# EAGLE design POV (EAGLE 9.6.2)
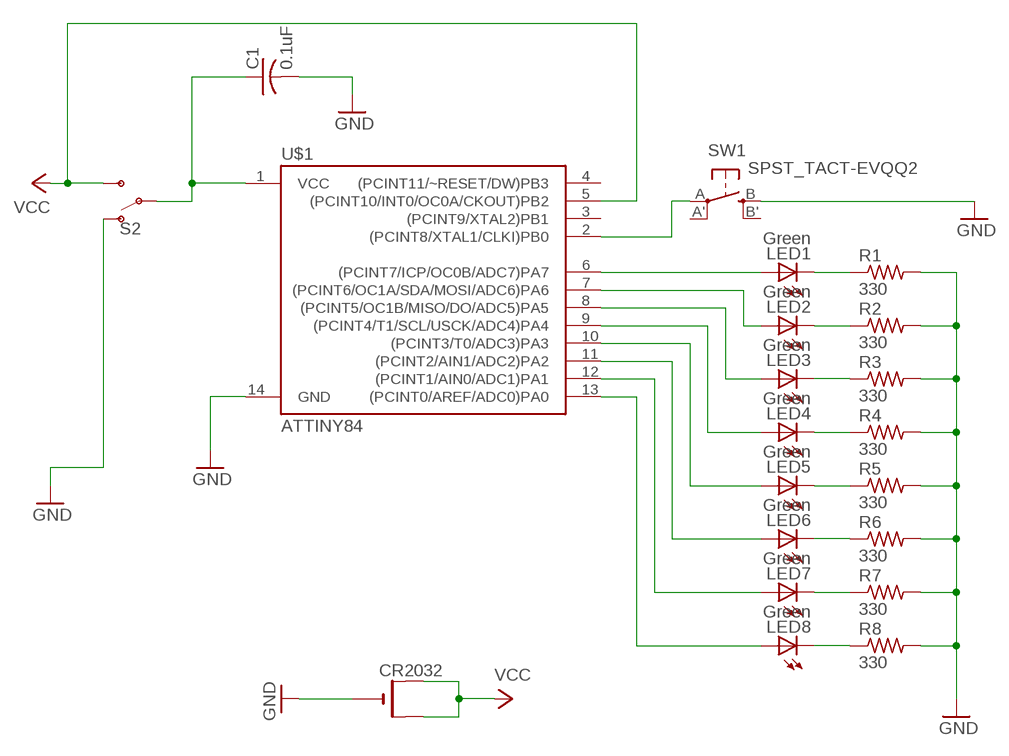
[diagram p0: schematic, sheet 1]

## Parts
C1  0.1uF  C-USC0805  [C0805]
CR2032  CR2032SMT  [CR2032-SMD]
LED1  Green  LEDCHIP-LED0805  [CHIP-LED0805]
LED2  Green  LEDCHIP-LED0805  [CHIP-LED0805]
LED3  Green  LEDCHIP-LED0805  [CHIP-LED0805]
LED4  Green  LEDCHIP-LED0805  [CHIP-LED0805]
LED5  Green  LEDCHIP-LED0805  [CHIP-LED0805]
LED6  Green  LEDCHIP-LED0805  [CHIP-LED0805]
LED7  Green  LEDCHIP-LED0805  [CHIP-LED0805]
LED8  Green  LEDCHIP-LED0805  [CHIP-LED0805]
R1  330  R-US_M0805  [M0805]
R2  330  R-US_M0805  [M0805]
R3  330  R-US_M0805  [M0805]
R4  330  R-US_M0805  [M0805]
R5  330  R-US_M0805  [M0805]
R6  330  R-US_M0805  [M0805]
R7  330  R-US_M0805  [M0805]
R8  330  R-US_M0805  [M0805]
S2  SWITCH-SPDT-SMD-AYZ0202  [SWITCH_DPDT_SMD_AYZ0202]
SW1  SPST_TACT-EVQQ2  [EVQ-Q2]
U$1  ATTINY84  [SO14]

## Nets
GND: C1.2 CR2032.- R1.2 R2.2 R3.2 R4.2 R5.2 R6.2 R7.2 R8.2 S2.1(O) SW1.B(S) U$1.14(GND)
N$1: LED1.A U$1.6((PCINT7/ICP/OC0B/ADC7)PA7)
N$2: LED1.C R1.1
N$3: LED2.C R2.1
N$4: LED3.C R3.1
N$5: LED4.C R4.1
N$6: LED5.C R5.1
N$7: LED6.C R6.1
N$8: LED7.C R7.1
N$9: LED8.C R8.1
N$10: LED2.A U$1.7((PCINT6/OC1A/SDA/MOSI/ADC6)PA6)
N$11: LED3.A U$1.8((PCINT5/OC1B/MISO/DO/ADC5)PA5)
N$12: LED4.A U$1.9((PCINT4/T1/SCL/USCK/ADC4)PA4)
N$13: LED5.A U$1.10((PCINT3/T0/ADC3)PA3)
N$14: LED6.A U$1.11((PCINT2/AIN1/ADC2)PA2)
N$15: LED7.A U$1.12((PCINT1/AIN0/ADC1)PA1)
N$16: LED8.A U$1.13((PCINT0/AREF/ADC0)PA0)
N$17: C1.1 S2.2(P) U$1.1(VCC)
N$18: SW1.A(P) U$1.2((PCINT8/XTAL1/CLKI)PB0)
VCC: CR2032.+$1(+) CR2032.+$2(+1) S2.3(S) U$1.5((PCINT10/INT0/OC0A/CKOUT)PB2)
Unconnected: SW1.A'(P1) SW1.B'(S1) U$1.3((PCINT9/XTAL2)PB1) U$1.4((PCINT11/~RESET/DW)PB3)

## Library data of the parts
C1 = adafruit:C-US: CAPACITOR, American symbol
CR2032 = adafruit:CR2032
LED1-LED8 = Fidget Spinner Example:LED: LED OSRAM: - CHIPLED LG R971, LG N971, LY N971, LG Q971, LY Q971, LO R971, LY R971 LH N974, LH R974 LS Q976, LO Q976, LY Q976 LO Q996 - Hyper CHIPLED LW Q18S LB Q993, LB Q99A, LB R99A - SideLED LS A670, LO A670, LY A670, LG A670, LP A670 LB A673, LV A673, LT A673, LW A673 LH A674 LY A675 LS A676, LA A676, LO A676, LY A676, LW A676 LS A679, LY A679, LG A679 - Hyper Micro SIDELED® LS Y876, LA Y876, LO Y876, LY Y876 LT Y87S - SmartLED LW L88C, LW L88S LB L89C, LB L89S, LG L890 LS L89K, LO L89K, LY L89K LS L896, LA L896, LO L896, LY L896 - TOPLED LS T670, LO T670, LY T670, LG T670, LP T670 LSG T670, LSP T670, LSY T670, LOP T670, LYG T670 LG T671, LOG T671, LSG T671 LB T673, LV T673, LT T673, LW T673 LH T674 LS T676, LA T676, LO T676, LY T676, LB T676, LH T676, LSB T676, LW T676 LB T67C, LV T67C, LT T67C, LS T67K, LO T67K, LY T67K, LW E67C LS E67B, LA E67B, LO E67B, LY E67B, LB E67C, LV E67C, LT E67C LW T67C LS T679, LY T679, LG T679 LS T770, LO T770, LY T770, LG T770, LP T770 LB T773, LV T773, LT T773, LW T773 LH T774 LS E675, LA E675, LY E675, LS T675 LS T776, LA T776, LO T776, LY T776, LB T776 LHGB T686 LT T68C, LB T68C - Hyper Mini TOPLED® LB M676 - Mini TOPLED Santana® LG M470 LS M47K, LO M47K, LY M47K Source: http://www.osram.convergy.de LUXEON: - LUMILED® LXK2-PW12-R00, LXK2-PW12-S00, LXK2-PW14-U00, LXK2-PW14-V00 LXK2-PM12-R00, LXK2-PM12-S00, LXK2-PM14-U00 LXK2-PE12-Q00, LXK2-PE12-R00, LXK2-PE12-S00, LXK2-PE14-T00, LXK2-PE14-U00 LXK2-PB12-K00, LXK2-PB12-L00, LXK2-PB12-M00, LXK2-PB14-N00, LXK2-PB14-P00, LXK2-PB14-Q00 LXK2-PR12-L00, LXK2-PR12-M00, LXK2-PR14-Q00, LXK2-PR14-R00 LXK2-PD12-Q00, LXK2-PD12-R00, LXK2-PD12-S00 LXK2-PH12-R00, LXK2-PH12-S00 LXK2-PL12-P00, LXK2-PL12-Q00, LXK2-PL12-R00 Source: www.luxeon.com KINGBRIGHT: KA-3528ASYC Source: www.kingbright.com
R1-R8 = adafruit:R-US_: RESISTOR, American symbol
S2 = SparkFun-Switches:SWITCH-SPDT: Single Pole, Double Throw (SPDT) Switch Single-pole, double-throw (SPDT) switch. Variant Overview SMD-AYZ0202 Surface Mount DPDT Switch <https://www.sparkfun.com/products/597> (COM-00597) Used on e.g. LilyPad Arduino USB - ATmega32U4 Board <https://www.sparkfun.com/products/12049> PTH-11.6X4.0MM SPDT Mini Power Switch <https://www.sparkfun.com/products/102> (COM-00102) Used on e.g. SparkFun Simon Says - Through-Hole Soldering Kit <https://www.sparkfun.com/products/10547> (KIT-10547) PTH-11.6X4.0MM-KIT KIT version of SPDT Mini Power Switch - Simplifies soldering by removing tStop of switch pins - only one side can be soldered. PTH-11.6X4.0MM-LOCK LOCK version of SPDT Mini Power Switch - Offset pins hold switch in place for easier soldering. SMD-RIGHT-ANGLE Surface Mount Right Angle Switch <https://www.sparkfun.com/products/10860> (COM-10860) Used on e.g. SparkFun ESP8266 Thing <https://www.sparkfun.com/products/13231>; PROD_ID: SWCH-08179; SF_ID: COM-00597
SW1 = adafruit:SPST_TACT: SMT 6mm switch, EVQQ2 series http://www.ladyada.net/library/eagle
U$1 = Fidget Spinner Example:ATTINY84: Atmel 14-pin 2/4/8kB flash uC Datasheet <https://cdn.sparkfun.com/datasheets/Widgets/doc8006.pdf> SparkFun Products Tiny AVR Programmer <https://www.sparkfun.com/products/11801> (PGM-11801) SparkFun Servo Trigger - Continuous Rotation <https://www.sparkfun.com/products/13872> (WIG-13872) SparkFun Servo Trigger <https://www.sparkfun.com/products/13118> (WIG-13118); PROD_ID: IC-11285

## Board
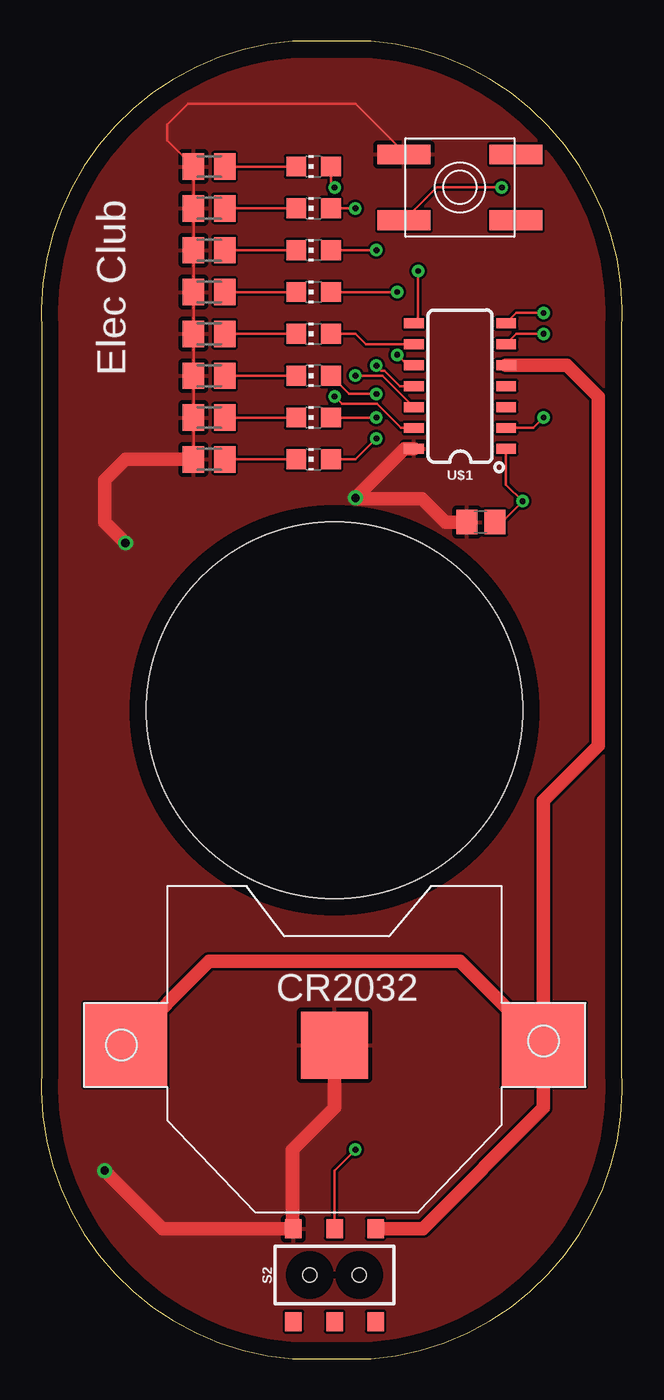
[diagram p1: board, top side]
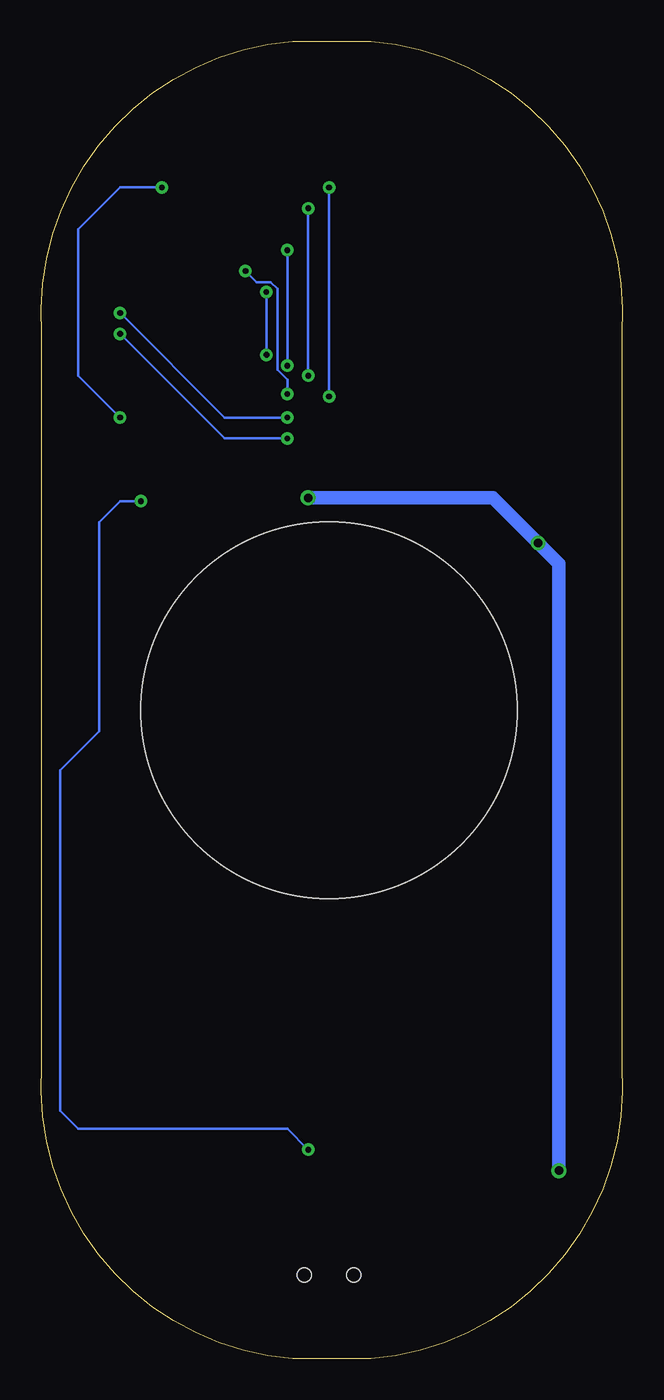
[diagram p2: board, bottom side, seen from below]

Size 35.32 x 80 mm. Coordinates in mm from the lower left corner, seen from the top.
Outline: 0.05,62.22 0.05,17.78 arc90 15.29,0 20.04,0 arc90 35.28,17.78 35.28,62.22 arc90 20.04,80 15.29,80 arc90 0.05,62.22
Copper layers (1*16): Top 0.035mm / dielectric 1.5mm / Bottom 0.035mm
Design rules "default": minimum track width 6mil, minimum drill 0.35mm, track to track 6mil, track to pad 6mil, pad to pad 6mil, via to via 6mil, smd to smd 6mil, copper to edge 40mil, drill to drill 6mil, minimum pad ring 10mil, minimum via ring 8mil, stop-mask expansion 4mil, vias tented up to drill 0mil, thermal gap 10mil
Holes 22.86 mm at 17.83,39.37

### Footprints (pad centres in the part's own frame; a part is rotated, then mirrored left to right if it is on the bottom)
C0805 = smd 1.3 x 1.5: 1 -0.85,0; 2 0.85,0
CR2032-SMD = smd 5.08 x 5.08: +$1 -12.7,0; +$2 12.7,0 | smd 4.064 x 4.064: - 0,0
CHIP-LED0805 = smd 1.2 x 1.2: A 0,-1.05; C 0,1.05
M0805 = smd 1.3 x 1.6: 1 -0.95,0; 2 0.95,0
SWITCH_DPDT_SMD_AYZ0202 = smd 1 x 1.15: 1 -2.5,2.825; 2 0,2.825; 3 2.5,2.825; 4 -2.5,-2.825; 5 0,-2.825; 6 2.5,-2.825 | hole 0.85: 1.5,0; -1.5,0
EVQ-Q2 = smd 3.2 x 1.2: A -3.4,-2; A' 3.4,-2; B -3.4,2; B' 3.4,2
SO14 = smd 0.6 x 1.2: 1 -3.175,-2.8; 2 -1.905,-2.8; 3 -0.635,-2.8; 4 0.635,-2.8; 5 1.905,-2.8; 6 3.175,-2.8; 7 4.445,-2.8; 8 4.445,2.8; 9 3.175,2.8; 10 1.905,2.8; 11 0.635,2.8; 12 -0.635,2.8; 13 -1.905,2.8; 14 -3.175,2.8

### Placement (x,y rotation side)
C1  26.72,50.8 180 top
CR2032  17.83,19.05 0 top
LED1  16.56,54.61 90 top
LED2  16.56,57.15 90 top
LED3  16.56,59.69 90 top
LED4  16.56,62.23 90 top
LED5  16.56,64.77 90 top
LED6  16.56,67.31 90 top
LED7  16.56,69.85 90 top
LED8  16.56,72.39 90 top
R1  10.21,54.61 180 top
R2  10.21,57.15 180 top
R3  10.21,59.69 180 top
R4  10.21,62.23 180 top
R5  10.21,64.77 180 top
R6  10.21,67.31 180 top
R7  10.21,69.85 180 top
R8  10.21,72.39 180 top
S2  17.83,5.08 0 top
SW1  25.45,71.12 0 top
U$1  25.45,58.42 90 top

### Tracks (layer width: path | path; a pad name or v marks a point on that pad's centre or on a via)
GND  (via drill 0.5)
  Top 0.152: R1.2 R2.2 R3.2 R4.2 R5.2 R6.2 R7.2 R8.2 7.67,73.98 7.67,74.93 8.94,76.2 19.1,76.2 22.05,73.25 SW1.B
  Top 0.813: v3.86,11.43 7.38,7.91 S2.1 15.29,7.95 15.29,12.7 17.83,15.24 CR2032.- | 19.1,52.22 v19.1,52.27 | v19.1,52.27 22.07,55.24 U$1.14 | v19.1,52.27 19.14,52.22 23.15,52.22 24.57,50.8 C1.2 | v5.13,49.53 3.86,50.8 3.86,53.34 5.13,54.61 R1.2
  Bottom 0.813: v3.86,11.43 3.86,48.26 v5.13,49.53 7.87,52.27 v19.1,52.27
  pour Top: -2.49,77.47 -2.49,5.61 arc45 -1.22,2.54 arc45 7.97,-1.27 33.07,-1.27 35.08,0.74 arc45 36.88,5.08 36.88,75.15 arc45 34.34,81.28 1.32,81.28 arc45 -0.85,80.38 -2.49,78.74
N$1  (via drill 0.35)
  Top 0.152: U$1.6 28.88,62.23 v30.53,62.23 | v20.37,55.88 19.1,54.61 LED1.A
  Bottom 0.152: v30.53,62.23 24.18,55.88 v20.37,55.88
N$2
  Top 0.152: R1.1 LED1.C
N$3
  Top 0.152: R2.1 LED2.C
N$4
  Top 0.152: R3.1 LED3.C
N$5
  Top 0.152: R4.1 LED4.C
N$6
  Top 0.152: R5.1 LED5.C
N$7
  Top 0.152: R6.1 LED6.C
N$8
  Top 0.152: R7.1 LED7.C
N$9
  Top 0.152: R8.1 LED8.C
N$10  (via drill 0.35)
  Top 0.152: U$1.7 28.88,63.5 v30.53,63.5 | v20.37,57.15 LED2.A
  Bottom 0.152: v30.53,63.5 24.18,57.15 v20.37,57.15
N$11  (via drill 0.35)
  Top 0.152: LED3.A 18.71,58.59 v20.37,58.59 | v22.91,66.04 22.91,63.12 U$1.8
  Bottom 0.152: v20.37,58.59 20.37,59.44 20.97,60.05 20.97,64.97 21.39,65.38 22.24,65.38 v22.91,66.04
N$12
  Top 0.152: U$1.9 19.73,61.59 19.1,62.23 LED4.A
N$13  (via drill 0.35)
  Top 0.152: U$1.10 22.27,60.33 v21.63,60.96 | v21.64,64.77 LED5.A
  Bottom 0.152: v21.63,60.96 v21.63,64.77 v21.64,64.77
N$14  (via drill 0.35)
  Top 0.152: U$1.11 21.81,59.05 20.87,59.99 20.67,59.99 v20.37,60.3 | v20.37,67.31 LED6.A
  Bottom 0.152: v20.37,60.3 v20.37,67.31
N$15  (via drill 0.35)
  Top 0.152: U$1.12 20.74,59.69 v19.1,59.69 | v19.1,69.85 LED7.A
  Bottom 0.152: v19.1,59.69 v19.1,69.85
N$16  (via drill 0.35)
  Top 0.152: v17.83,58.42 18.27,57.98 20.4,57.98 21.86,56.52 U$1.13 | v17.83,71.12 17.61,71.34 LED8.A
  Bottom 0.152: v17.83,58.42 v17.83,71.12
N$17  (via drill 0.35)
  Top 0.152: S2.2 17.83,11.43 v19.1,12.7 | C1.1 27.99,50.8 v29.26,52.07 28.25,53.08 U$1.1
  Bottom 0.152: v19.1,12.7 20.37,13.97 33.07,13.97 34.16,15.06 34.16,15.24 34.16,35.73 31.8,38.1 31.8,50.8 30.53,52.07 v29.26,52.07
N$18  (via drill 0.35)
  Top 0.152: SW1.A 24.05,71.12 v27.99,71.12 | v30.53,57.15 29.89,56.52 U$1.2
  Bottom 0.152: v27.99,71.12 30.53,71.12 33.07,68.58 33.07,59.69 v30.53,57.15
VCC
  Top 0.813: CR2032.+$1 10.21,24.13 25.45,24.13 29.26,20.32 30.53,20.32 CR2032.+$2 | CR2032.+$2 30.53,15.24 23.19,7.91 S2.3 | CR2032.+$2 30.53,33.89 33.85,37.22 33.85,58.42 31.95,60.33 U$1.5

### Text on the board
tPlace: Elec Club